# EasyEDA Pro project ProPrj_red-panda-afm_2025-05-21.epro, schematic Schematic1

## Sheets
1 P1: Board Name: PIEZO_Driver; Create Date: 2024-12-08; Page Name: P1; Project Name: red-panda-afm; Schematic Name: Schematic1; Update Date: 2024-12-16; Company: EasyEDA.com; Drawn: EasyEDA; Page Size: A3; Part Number: JLCPCB-001; Reviewed: EasyEDA; Version: V0.1
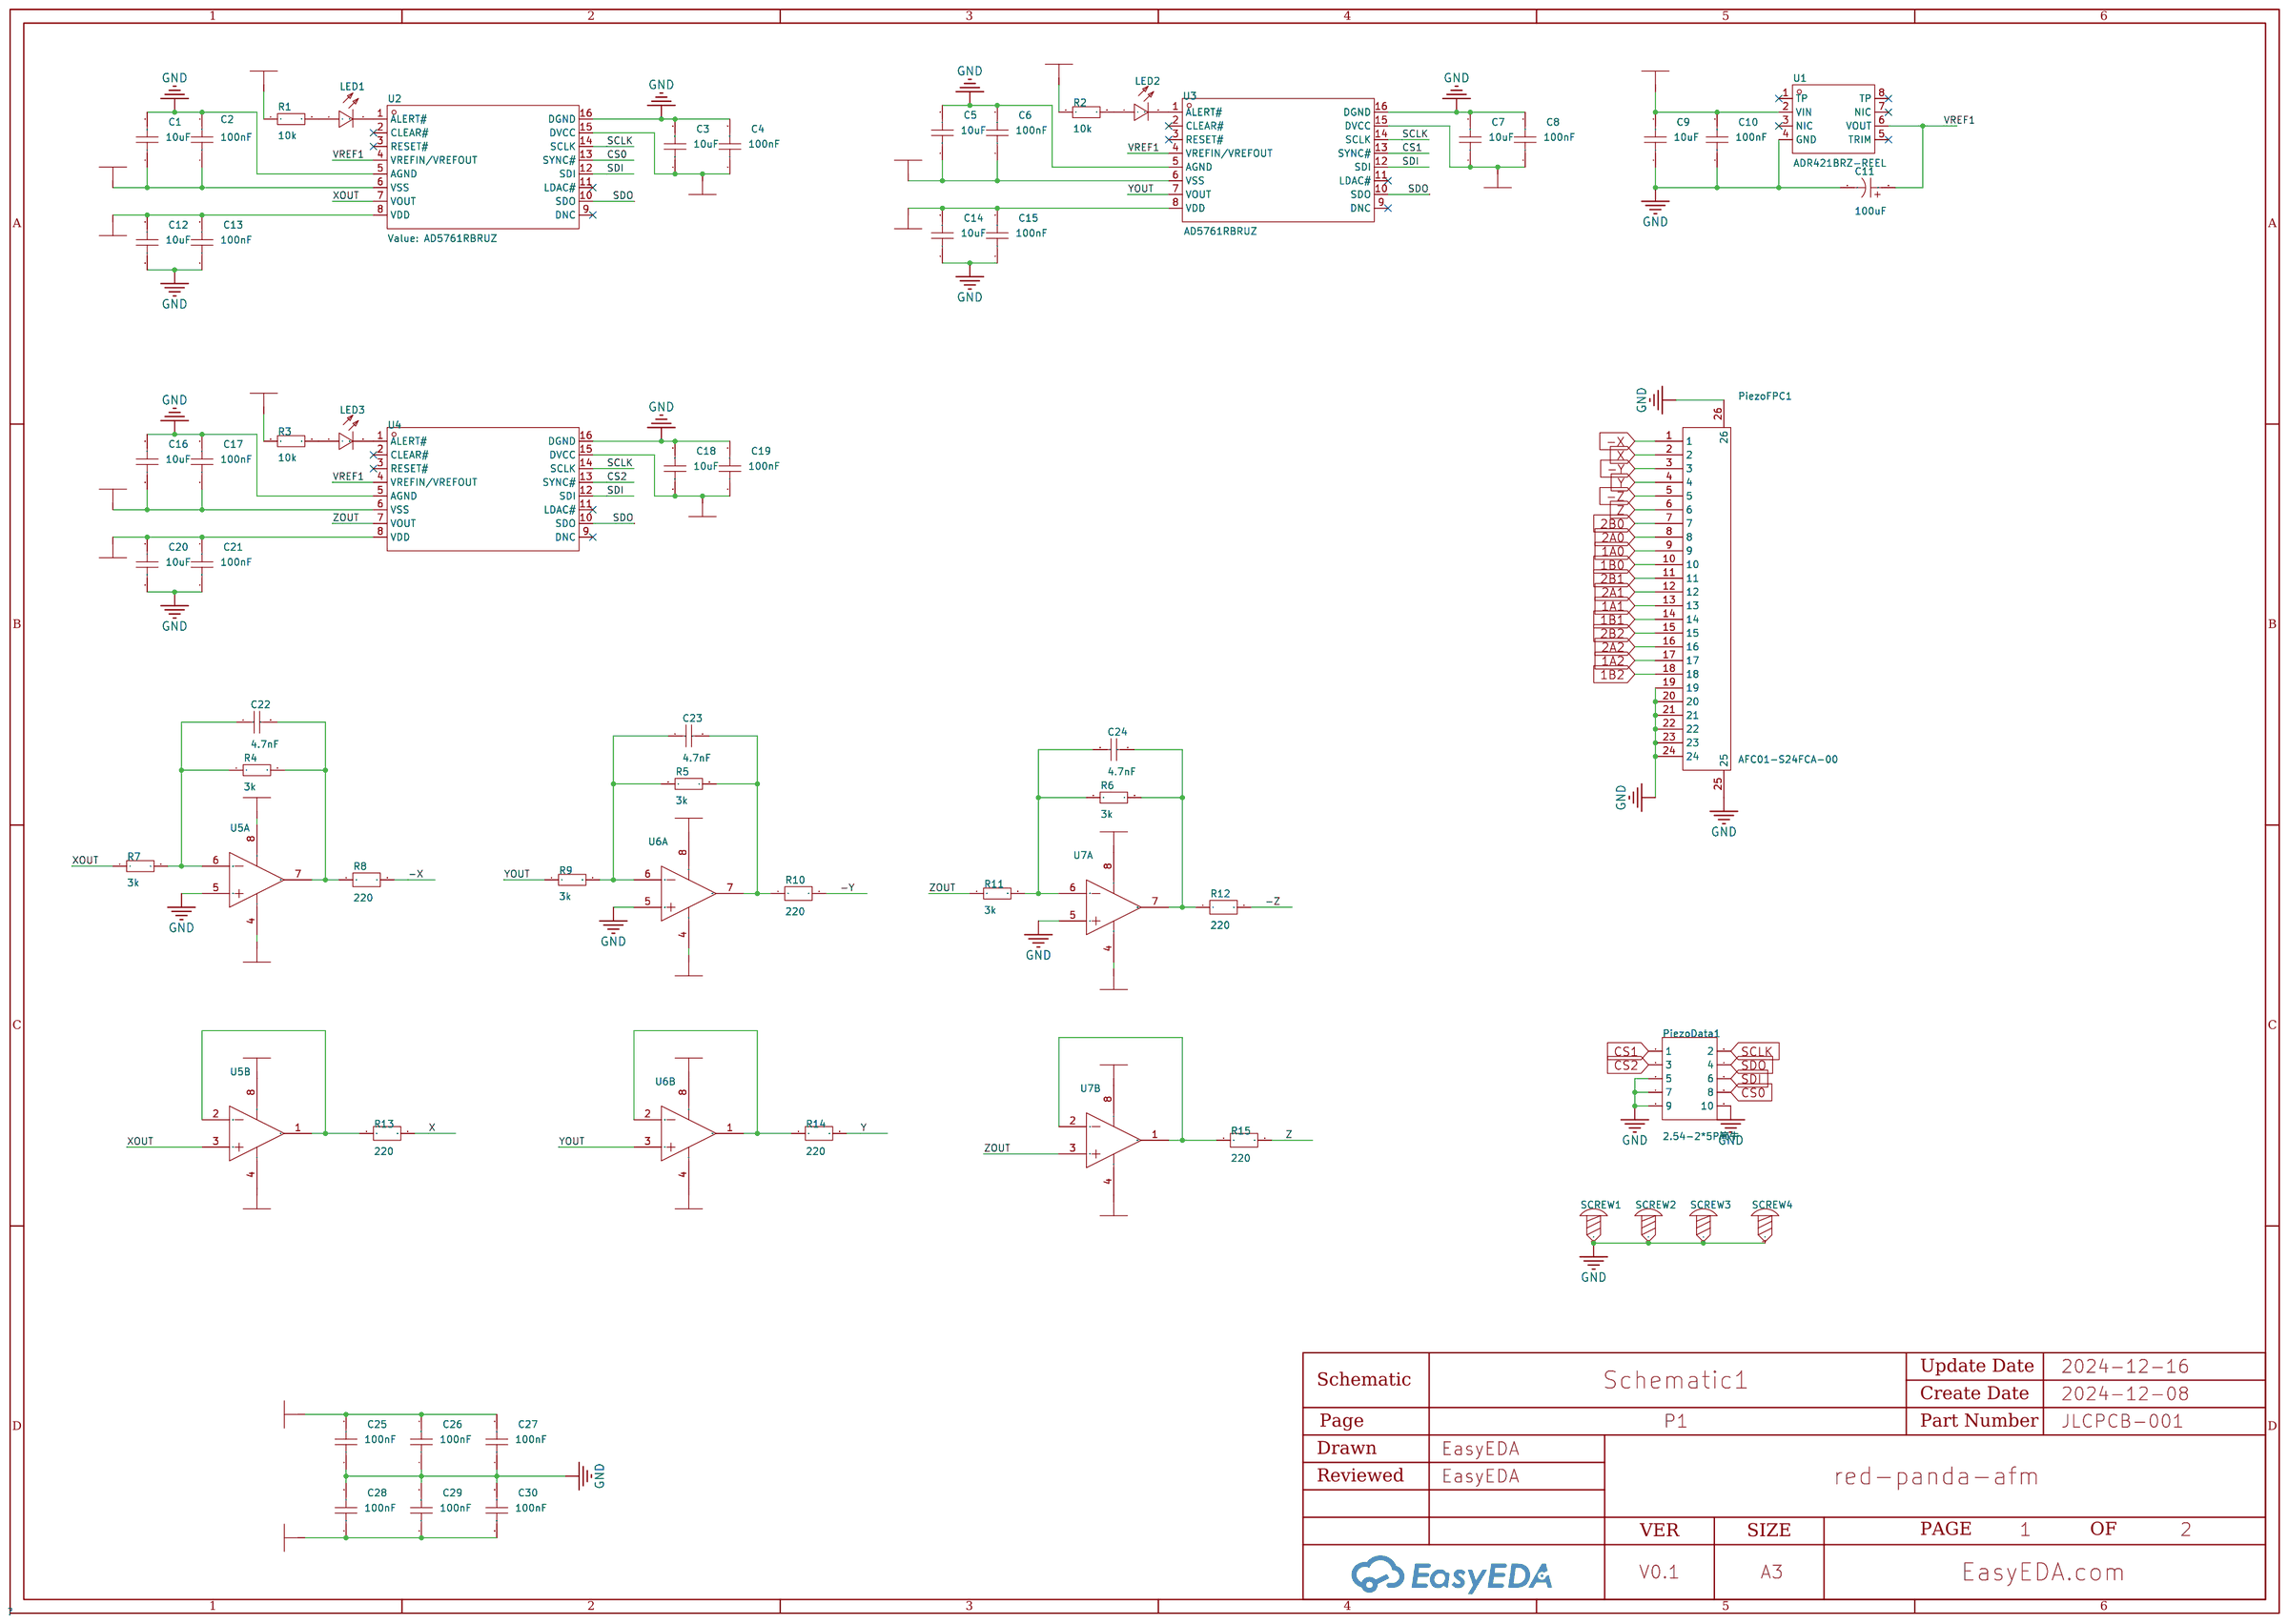
[diagram p0: P1]
2 P2: Create Date: 2024-12-09; Page Name: P2; Update Date: 2025-02-02; Company: 嘉立创EDA; Page Size: A4; Version: V1.0
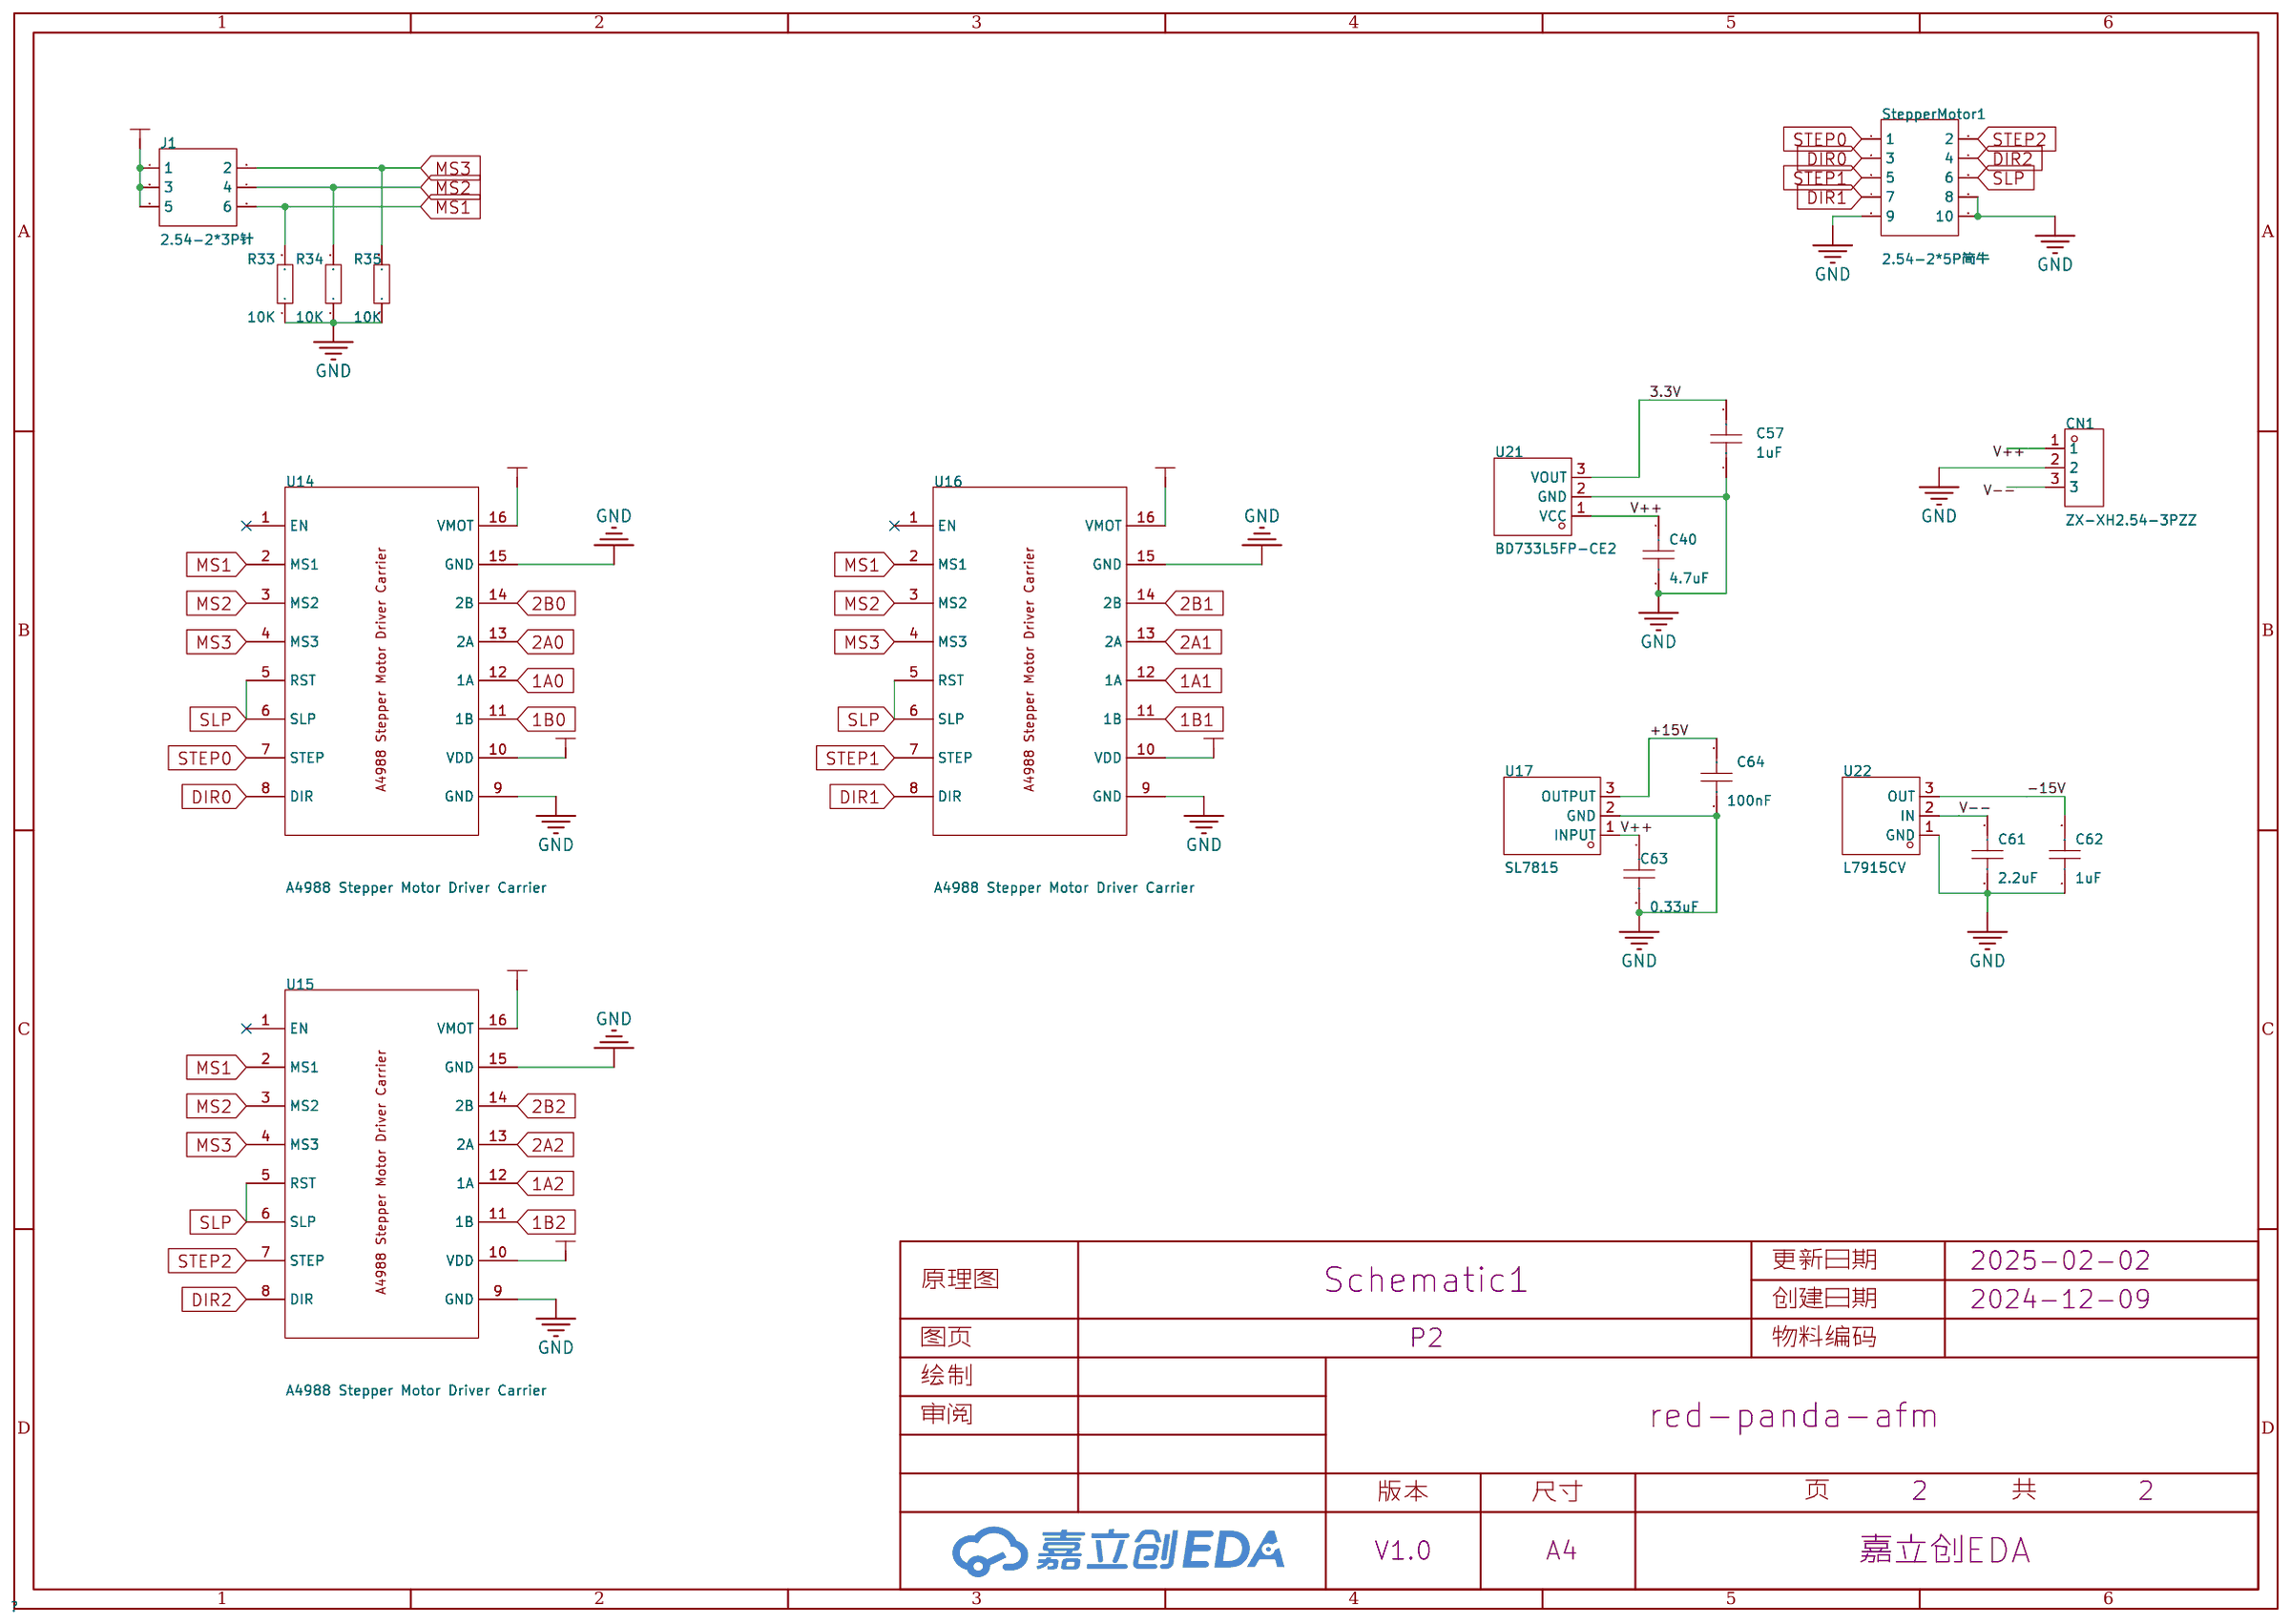
[diagram p1: P2]

## Parts
sheet P1
C1  10uF  [C0603]
C2  100nF  [C0603]
C3  10uF  [C0603]
C4  100nF  [C0603]
C5  10uF  [C0603]
C6  100nF  [C0603]
C7  10uF  [C0603]
C8  100nF  [C0603]
C9  10uF  [C0603]
C10  100nF  [C0603]
C11  100uF  [CAP-SMD_L7.3-W4.3-FD]
C12  10uF  [C0603]
C13  100nF  [C0603]
C14  10uF  [C0603]
C15  100nF  [C0603]
C16  10uF  [C0603]
C17  100nF  [C0603]
C18  10uF  [C0603]
C19  100nF  [C0603]
C20  10uF  [C0603]
C21  100nF  [C0603]
C22  4.7nF  [C0603]
C23  4.7nF  [C0603]
C24  4.7nF  [C0603]
C25  100nF  [C0603]
C26  100nF  [C0603]
C27  100nF  [C0603]
C28  100nF  [C0603]
C29  100nF  [C0603]
C30  100nF  [C0603]
LED1  -  [LED0603-R-RD]
LED2  -  [LED0603-R-RD]
LED3  -  [LED0603-R-RD]
PiezoData1  2.54-2*5P简牛  [IDC-TH_10P-P2.54_C5665]
PiezoFPC1  AFC01-S24FCA-00  [FPC-SMD_P0.50-24P_FGS-XJ-H2.0]
R1  10k  [R0603]
R2  10k  [R0603]
R3  10k  [R0603]
R4  3k  [R0603]
R5  3k  [R0603]
R6  3k  [R0603]
R7  3k  [R0603]
R8  220  [R0603]
R9  3k  [R0603]
R10  220  [R0603]
R11  3k  [R0603]
R12  220  [R0603]
R13  220  [R0603]
R14  220  [R0603]
R15  220  [R0603]
SCREW1  -  [Screw-Hole-M3]
SCREW2  -  [Screw-Hole-M3]
SCREW3  -  [Screw-Hole-M3]
SCREW4  -  [Screw-Hole-M3]
U1  ADR421BRZ-REEL  [SOIC-8_L4.9-W3.9-P1.27-LS6.0-BL]
U2  AD5761RBRUZ  [TSSOP-16_L5.0-W4.4-P0.65-LS6.4-TL]
U3  AD5761RBRUZ  [TSSOP-16_L5.0-W4.4-P0.65-LS6.4-TL]
U4  -  [TSSOP-16_L5.0-W4.4-P0.65-LS6.4-TL]
U5  OPA2227P  [PDIP-8_L9.6-W6.4-P2.54-LS7.6-BL]  (sections 1,2)
U6  OPA2227P  [PDIP-8_L9.6-W6.4-P2.54-LS7.6-BL]  (sections 1,2)
U7  OPA2227P  [PDIP-8_L9.6-W6.4-P2.54-LS7.6-BL]  (sections 1,2)
sheet P2
C40  4.7uF  [C0603]
C57  1uF  [C0603]
C61  2.2uF  [C0603]
C62  1uF  [C0603]
C63  0.33uF  [C0603]
C64  100nF  [C0603]
CN1  ZX-XH2.54-3PZZ  [CONN-TH_3P-P2.54_2501S-3P]
J1  2.54-2*3P针  [HDR-TH_6P-P2.54-V-M-R2-C3-S2.54-1]
R33  10K  [R0603]
R34  10K  [R0603]
R35  10K  [R0603]
StepperMotor1  2.54-2*5P简牛  [IDC-TH_10P-P2.54_C5665]
U14  A4988 Stepper Motor Driver Carrier  [A4988 STEPPER MOTOR DRIVER CARRIER]
U15  A4988 Stepper Motor Driver Carrier  [A4988 STEPPER MOTOR DRIVER CARRIER]
U16  A4988 Stepper Motor Driver Carrier  [A4988 STEPPER MOTOR DRIVER CARRIER]
U17  SL7815  [TO-220-3_L10.0-W4.5-P2.54-L]
U21  BD733L5FP-CE2  [TO-252-3L_L6.6-W6.1-P4.60-LS9.5-BR-CW]
U22  L7915CV  [TO-220-3_L10.0-W4.5-P2.54-L]

## Library data of the parts
C1 C3 C5 C7 C9 C12 C14 C16 C18 C20 = GRM188R61E106MA73D: 容值:10uF;精度:±20%;额定电压:25V;温度系数:X5R;; LCSC Part Name: 10uF ±20% 25V; Supplier Part: C91606; Manufacturer: muRata(村田); Supplier Footprint: 0603; JLCPCB Part Class: Extended Part; Datasheet: https://atta.szlcsc.com/upload/public/pdf/source/20161226/1482720176185.pdf; Supplier: LCSC; Tolerance: ±20%; Voltage Rated: 25V; Temperature Coefficient: X5R
C2 C4 C6 C8 C10 C13 C15 C17 C19 C21 C25-C30 = CL10B104KA8NNNC: 容值:100nF;精度:±10%;额定电压:25V;温度系数:X7R;; LCSC Part Name: 100nF ±10% 25V; Supplier Part: C1590; Manufacturer: SAMSUNG(三星); Supplier Footprint: 0603; JLCPCB Part Class: Extended Part; Datasheet: https://atta.szlcsc.com/upload/public/pdf/source/20160103/1457707680294.pdf; Supplier: LCSC; Tolerance: ±10%; Voltage Rated: 25V; Temperature Coefficient: X7R
C11 = F931D107MNC: Capacitance: Tolerance:±20% Tolerance:±20% Rated Voltage: Leakage Current(DCL):- Ripple Current:- Equivalent Series Resistance(ESR):500mΩ@100kHz Operating Temperature:-55℃~+125℃ Operating Temperature:-55℃~+125℃; LCSC Part Name: 100uF ±20% 20V; Supplier Part: C1870833; Manufacturer: Kyocera AVX; Supplier Footprint: 2917; JLCPCB Part Class: Extended Part; Supplier: LCSC; Tolerance: ±20%; Equivalent Series Resistance(ESR): 500mΩ@100kHz; Operating Temperature: -55℃~+125℃
C22-C24 = 0603B472K500NT: 容值:4.7nF;精度:±10%;额定电压:50V;温度系数:X7R;; LCSC Part Name: 4.7nF ±10% 50V; Supplier Part: C53987; Manufacturer: FH(风华); Supplier Footprint: 0603; JLCPCB Part Class: Basic Part; Datasheet: https://atta.szlcsc.com/upload/public/pdf/source/20170923/C53987_1506149489951988835.pdf; Supplier: LCSC; Tolerance: ±10%; Voltage Rated: 50V; Temperature Coefficient: X7R
LED1-LED3 = 19-217/R6C-AL1M2VY/3T: 发光颜色:红灯;二极管配置:-;透镜颜色:无色透明;主波长:617.5nm;峰值波长:632nm;色温:-;光通量(25时):-;测试电流:5mA;正向电压(VF):2.2V;发光强度:28.5mcd;功率:60mW;发光角度:120°;安装方式:-;工作温度:-40~+85;; LCSC Part Name: 0603 红灯; Supplier Part: C72044; Manufacturer: EVERLIGHT(台湾亿光); Supplier Footprint: 0603; JLCPCB Part Class: Extended Part; Datasheet: https://atta.szlcsc.com/upload/public/pdf/source/20160507/1462613613821.pdf; Supplier: LCSC; Emitted Color: 红灯; Lens Color: 无色透明; Dominant Wavelength: 617.5nm; Peak Wavelength: 632nm; Forward Current: 5mA; Forward Voltage (VF): 2.2V; Luminous Intensity: 28.5mcd; Power Dissipation: 60mW; Viewing Angle: 120°; Operating Temperature: -40~+85
PiezoData1 StepperMotor1 = 2.54-2*5P简牛: Connector Type:简牛座 Pitch:2.54mm Structure:2x5P Holder Type:Straight Row Spacing:2.54mm Number of Rows:2 Pin Number in each Row:5 Contact Material:- Contact Plating:-; LCSC Part Name: 2.54mm 2x5P 排数:2 每排P数:5; Supplier Part: C5665; Manufacturer: BOOMELE(博穆精密); Supplier Footprint: 插件,P=2.54mm; JLCPCB Part Class: Extended Part; Datasheet: https://atta.szlcsc.com/upload/public/pdf/source/20140331/1457707037896.pdf; Supplier: LCSC; Connector Type: 简牛座; Pitch: 2.54mm; Structure: 2x5P; Holder Type: Straight; Row Spacing: 2.54mm; Number of Rows: 2; Pin Number in each Row: 5
PiezoFPC1 = AFC01-S24FCA-00: 锁定特性:翻盖式;触点类型:下接;触点数量:24P;间距:0.5mm;安装类型:卧贴;; LCSC Part Name: 间距:0.5mm P数:24P 翻盖式 下接; Supplier Part: C262669; Manufacturer: JS(钜硕电子); Supplier Footprint: SMD,P=0.5mm,卧贴; JLCPCB Part Class: Extended Part; Datasheet: https://atta.szlcsc.com/upload/public/pdf/source/20190816/C413942_2A72D1AC756EAE17EEDF756A339D4500.pdf; Supplier: LCSC; Locking Feature: 翻盖式; Contact Type: 下接; Number of Contacts: 24P; Pitch: 0.5mm; Mounting Type: 卧贴; FFC, FCB Thickness: 0.3mm; Height Above Board: 2mm
R1-R3 = 0603WAF1002T5E: 电阻类型:厚膜电阻;阻值:10k;精度:±1%;功率:1/10W;温度系数:±100ppm/;最大工作电压:75V;工作温度范围:-55~+155;; LCSC Part Name: 10k ±1%; Supplier Part: C25804; Manufacturer: UNI-ROYAL(厚声); Supplier Footprint: 0603; JLCPCB Part Class: Basic Part; Datasheet: https://atta.szlcsc.com/upload/public/pdf/source/20200306/C422600_1E6D84923E4A46A82E41ADD87F860B5C.pdf; Supplier: LCSC; Type: 厚膜电阻; Tolerance: ±1%; Power(Watts): 1/10W; Temperature Coefficient: ±100ppm/; Overload Voltage (Max): 75V; Operating Temperature Range: -55~+155
R4-R7 R9 R11 = ARG03DTC3001: 电阻类型:薄膜电阻;阻值:3k;精度:±0.5%;功率:100mW;温度系数:±25ppm/;最大工作电压:75V;工作温度范围:-55~+155;; LCSC Part Name: 3k ±0.5% 100mW; Supplier Part: C311916; Manufacturer: 光颉(Viking); Supplier Footprint: 0603; JLCPCB Part Class: Extended Part; Datasheet: https://atta.szlcsc.com/upload/public/pdf/source/20181119/C311916_083AB72433BF5B624DBE6C035DD51480.pdf; Supplier: LCSC; Type: 薄膜电阻; Tolerance: ±0.5%; Power(Watts): 100mW; Temperature Coefficient: ±25ppm/; Overload Voltage (Max): 75V; Operating Temperature Range: -55~+155
R8 R10 R12-R15 = ERJU3RD2200V: 阻值:220;精度:±0.5%;功率:100mW;温度系数:±50ppm/;最大工作电压:-;工作温度范围:-55~+155;; LCSC Part Name: 220 ±0.5% 100mW; Supplier Part: C491169; Manufacturer: PANASONIC(松下); Supplier Footprint: 0603; JLCPCB Part Class: Extended Part; Datasheet: https://atta.szlcsc.com/upload/public/pdf/source/20200407/C491169_AC2E94AF70820CF85EC0143B46F9F0DA.pdf; Supplier: LCSC; Tolerance: ±0.5%; Power(Watts): 100mW; Temperature Coefficient: ±50ppm/; Operating Temperature Range: -55~+155
SCREW1-SCREW4 = Screw-Hole-M3: Supplier Footprint: 插件
U1 = ADR421BRZ-REEL: Supplier Part: C496503; Manufacturer: ADI(亚德诺)/LINEAR; Supplier Footprint: SOIC-8; JLCPCB Part Class: Extended Part; Datasheet: https://atta.szlcsc.com/upload/public/pdf/source/20200316/C496503_A1F080746FA87D9455D96FF2B5AA62EC.pdf; Supplier: LCSC
U2-U4 = AD5761RBRUZ: D/A 位数:-;D/A通道数:-;输出类型:-;读写接口类型:-;; Supplier Part: C404015; Manufacturer: ADI(亚德诺)/LINEAR; Supplier Footprint: TSSOP-16; JLCPCB Part Class: Extended Part; Datasheet: https://atta.szlcsc.com/upload/public/pdf/source/20190722/C404015_21C88E48C88813C7B0010A18F7ED8816.pdf; Supplier: LCSC
U5-U7 = OPA2227P: 运放类型:General Purpose;放大器组数:2;增益带宽积（GBP）:8MHz;压摆率（SR）:2.3 V/us;电源电压:5V ~ 36V, ±2.5V ~ 18V;各通道供电电流:3.7mA;; Supplier Part: C1346534; Manufacturer: TI(德州仪器); Supplier Footprint: PDIP-8; JLCPCB Part Class: Extended Part; Datasheet: https://atta.szlcsc.com/upload/public/pdf/source/20210702/51099E56FC087785D4CD98B058FDBA2E.pdf; Supplier: LCSC; Amplifier Type: General Purpose; Number of Circuits: 2; Gain Bandwidth Product（GBP）: 8MHz; Slew Rate（SR）: 2.3 V/us; Supply Voltage（Single）: 5V ~ 36V, ±2.5V ~ 18V; Iq per channel (Typ): 3.7mA
C40 C57 C61-C64 = CAP_0603: Supplier Footprint: 0603
CN1 = ZX-XH2.54-3PZZ: Pins Structure:1x3P Pitch:2.54mm Mounting Style:Straight Reference Series:XH Number of Pins:3P Number of Rows:1 Number of PINs Per Row:3 Row Spacing:- Current Rating (Max):3A Contact Material:Brass Contact Plating:Tin Operating Temperature Range:-25℃~+85℃; Supplier Part: C7429633; Manufacturer: Megastar(兆星); Supplier Footprint: 插件,P=2.54mm; JLCPCB Part Class: Extended Part; Datasheet: https://atta.szlcsc.com/upload/public/pdf/source/20230619/AE17037A2CFDBE8D9CBA775D61AD0A84.pdf; Supplier: LCSC; Pins Structure: 1x3P; Pitch: 2.54mm; Mounting Style: Straight; Reference Series: XH; Number of Pins: 3P; Number of Rows: 1; Number of PINs Per Row: 3; Current Rating (Max): 3A; Contact Material: Brass; Contact Plating: Tin; Operating Temperature Range: -25℃~+85℃
J1 = 2.54-2*3P针: Pin Structure:- Pitch:2.54mm Row Spacing:- Circluar Pins/Square Pins:- Mounting Type:Straight Number of Rows:双排 Number of Pins:6P Current Rating (Max):- Voltage Rating (Max):- Length of Mating Pin:- Insulation Height:- Contact Material: Contact Plating:-; LCSC Part Name: 间距:2.54mm 直插; Supplier Part: C65114; Manufacturer: BOOMELE(博穆精密); Supplier Footprint: 插件,P=2.54mm; JLCPCB Part Class: Extended Part; Supplier: LCSC; Pitch: 2.54mm; Mounting Type: Straight; Number of Rows: 双排; Number of Pins: 6P; Color: Black
R33-R35 = Res_0603: Supplier Footprint: 0603
U14-U16 = A4988 Stepper Motor Driver Carrier
U17 = SL7815: Output Type: Output Polarity:Positive Number of Outputs:1 Maximum Input Voltage:30V Output Voltage:15V~15V Output Voltage:15V~15V Dropout Voltage:2V@(500mA) Output Current:1A Power Supply Rejection Ratio (PSRR):70dB@(120Hz); LCSC Part Name: 正 Vin=30V Vout=15V 1A 70dB@(120Hz); Supplier Part: C458979; Manufacturer: Slkor(萨科微); Supplier Footprint: TO-220; JLCPCB Part Class: Extended Part; Datasheet: https://atta.szlcsc.com/upload/public/pdf/source/20191121/C458979_7C045E8EA06C0BC569B49C0292DDB5EB.pdf; Supplier: LCSC; Output Polarity: Positive; Number of Outputs: 1; Maximum Input Voltage: 30V; Output Voltage: 15V~15V; Dropout Voltage: 2V@(500mA); Output Current: 1A; Power Supply Rejection Ratio (PSRR): 70dB@(120Hz)
U21 = BD733L5FP-CE2: Supplier Part: C509724; Manufacturer: ROHM(罗姆); Supplier Footprint: TO-252-3; JLCPCB Part Class: Extended Part; Datasheet: https://atta.szlcsc.com/upload/public/pdf/source/20230201/396DA52F76B265AFAA10405709CD3C0A.pdf; Supplier: LCSC
U22 = L7915CV: Output Type: Output Polarity:Negative Number of Outputs:1 Maximum Input Voltage:35V Output Voltage:15V~15V Output Voltage:15V~15V Dropout Voltage:1.1V@(1A) Output Current:1.5A Power Supply Rejection Ratio (PSRR):60dB@(120Hz); Supplier Part: C154950; Manufacturer: ST(意法半导体); Supplier Footprint: TO-220; JLCPCB Part Class: Extended Part; Datasheet: https://atta.szlcsc.com/upload/public/pdf/source/20180301/C154950_15198941423711383385.pdf; Supplier: LCSC; Output Polarity: Negative; Number of Outputs: 1; Maximum Input Voltage: 35V; Output Voltage: 15V~15V; Dropout Voltage: 1.1V@(1A); Output Current: 1.5A; Power Supply Rejection Ratio (PSRR): 60dB@(120Hz)

## Nets
3.3V: C3.1 C4.1 C7.1 C8.1 C18.1 C19.1 C57.2 J1.1 J1.3 J1.5 R1.1 R2.1 R3.1 U2.15(DVCC) U3.15(DVCC) U4.15(DVCC) U14.10(VDD) U15.10(VDD) U16.10(VDD) U21.3(VOUT)
+15V: C9.2 C10.2 C12.2 C13.2 C14.2 C15.2 C20.2 C21.2 C25.2 C26.2 C27.2 C64.2 U1.2(VIN) U2.8(VDD) U3.8(VDD) U4.8(VDD) U5.8(V+) U6.8(V+) U7.8(V+) U14.16(VMOT) U15.16(VMOT) U16.16(VMOT) U17.3(OUTPUT)
-15V: C1.1 C2.1 C5.1 C6.1 C16.1 C17.1 C28.1 C29.1 C30.1 C62.2 U2.6(VSS) U3.6(VSS) U4.6(VSS) U5.4(V-) U6.4(V-) U7.4(V-) U22.3(OUT)
GND: C1.2 C2.2 C3.2 C4.2 C5.2 C6.2 C7.2 C8.2 C9.1 C10.1 C11.2 C12.1 C13.1 C14.1 C15.1 C16.2 C17.2 C18.2 C19.2 C20.1 C21.1 C25.1 C26.1 C27.1 C28.2 C29.2 C30.2 C40.2 C57.1 C61.2 C62.1 C63.2 C64.1 CN1.2 PiezoData1.5 PiezoData1.7 PiezoData1.9 PiezoData1.10 PiezoFPC1.19 PiezoFPC1.20 PiezoFPC1.21 PiezoFPC1.22 PiezoFPC1.23 PiezoFPC1.24 PiezoFPC1.25 PiezoFPC1.26 R33.1 R34.1 R35.1 SCREW1.1 SCREW2.1 SCREW3.1 SCREW4.1 StepperMotor1.8 StepperMotor1.9 StepperMotor1.10 U1.4(GND) U2.5(AGND) U2.16(DGND) U3.5(AGND) U3.16(DGND) U4.5(AGND) U4.16(DGND) U5.5(IN B+) U6.5(IN B+) U7.5(IN B+) U14.9(GND) U14.15(GND) U15.9(GND) U15.15(GND) U16.9(GND) U16.15(GND) U17.2(GND) U21.2(GND) U22.1(GND)
1A0: PiezoFPC1.9 U14.12(1A)
1A1: PiezoFPC1.13 U16.12(1A)
1A2: PiezoFPC1.17 U15.12(1A)
1B0: PiezoFPC1.10 U14.11(1B)
1B1: PiezoFPC1.14 U16.11(1B)
1B2: PiezoFPC1.18 U15.11(1B)
2A0: PiezoFPC1.8 U14.13(2A)
2A1: PiezoFPC1.12 U16.13(2A)
2A2: PiezoFPC1.16 U15.13(2A)
2B0: PiezoFPC1.7 U14.14(2B)
2B1: PiezoFPC1.11 U16.14(2B)
2B2: PiezoFPC1.15 U15.14(2B)
-X: PiezoFPC1.1 R8.2
-Y: PiezoFPC1.3 R10.2
-Z: PiezoFPC1.5 R12.2
CS0: PiezoData1.8 U2.13(SYNC#)
CS1: PiezoData1.1 U3.13(SYNC#)
CS2: PiezoData1.3 U4.13(SYNC#)
DIR0: StepperMotor1.3 U14.8(DIR)
DIR1: StepperMotor1.7 U16.8(DIR)
DIR2: StepperMotor1.4 U15.8(DIR)
MS1: J1.6 R33.2 U14.2(MS1) U15.2(MS1) U16.2(MS1)
MS2: J1.4 R34.2 U14.3(MS2) U15.3(MS2) U16.3(MS2)
MS3: J1.2 R35.2 U14.4(MS3) U15.4(MS3) U16.4(MS3)
SCLK: PiezoData1.2 U2.14(SCLK) U3.14(SCLK) U4.14(SCLK)
SDI: PiezoData1.6 U2.12(SDI) U3.12(SDI) U4.12(SDI)
SDO: PiezoData1.4 U2.10(SDO) U3.10(SDO) U4.10(SDO)
SLP: StepperMotor1.6 U14.5(RST) U14.6(SLP) U15.5(RST) U15.6(SLP) U16.5(RST) U16.6(SLP)
STEP0: StepperMotor1.1 U14.7(STEP)
STEP1: StepperMotor1.5 U16.7(STEP)
STEP2: StepperMotor1.2 U15.7(STEP)
V++: C40.1 C63.1 CN1.1 U17.1(INPUT) U21.1(VCC)
V--: C61.1 CN1.3 U22.2(IN)
VREF1: C11.1 U1.6(VOUT) U2.4(VREFIN/VREFOUT) U3.4(VREFIN/VREFOUT) U4.4(VREFIN/VREFOUT)
X: PiezoFPC1.2 R13.2
XOUT: R7.1 U2.7(VOUT) U5.3(IN A+)
Y: PiezoFPC1.4 R14.2
YOUT: R9.1 U3.7(VOUT) U6.3(IN A+)
Z: PiezoFPC1.6 R15.2
ZOUT: R11.1 U4.7(VOUT) U7.3(IN A+)
$1N3650: LED2.2(C) U3.1(ALERT#)
$1N3651: LED2.1(A) R2.2
$1N3669: LED1.2(C) U2.1(ALERT#)
$1N3670: LED1.1(A) R1.2
$1N3706: LED3.2(C) U4.1(ALERT#)
$1N3707: LED3.1(A) R3.2
$1N3721: C22.2 R4.2 R8.1 U5.7(OUT B)
$1N3722: C22.1 R4.1 R7.2 U5.6(IN B-)
$1N3754: R13.1 U5.1(OUT A) U5.2(IN A-)
$1N16955: C23.2 R5.2 R10.1 U6.7(OUT B)
$1N16956: C23.1 R5.1 R9.2 U6.6(IN B-)
$1N16967: R14.1 U6.1(OUT A) U6.2(IN A-)
$1N17568: C24.2 R6.2 R12.1 U7.7(OUT B)
$1N17569: C24.1 R6.1 R11.2 U7.6(IN B-)
$1N17580: R15.1 U7.1(OUT A) U7.2(IN A-)

Not connected (* = marked no-connect by the designer): U1 1(TP)* 3(NIC)* 5(TRIM)* 7(NIC)* 8(TP)*; U2 2(CLEAR#)* 3(RESET#)* 9(DNC)* 11(LDAC#)*; U3 2(CLEAR#)* 3(RESET#)* 9(DNC)* 11(LDAC#)*; U4 2(CLEAR#)* 3(RESET#)* 9(DNC)* 11(LDAC#)*; U14 1(EN)*; U15 1(EN)*; U16 1(EN)*
